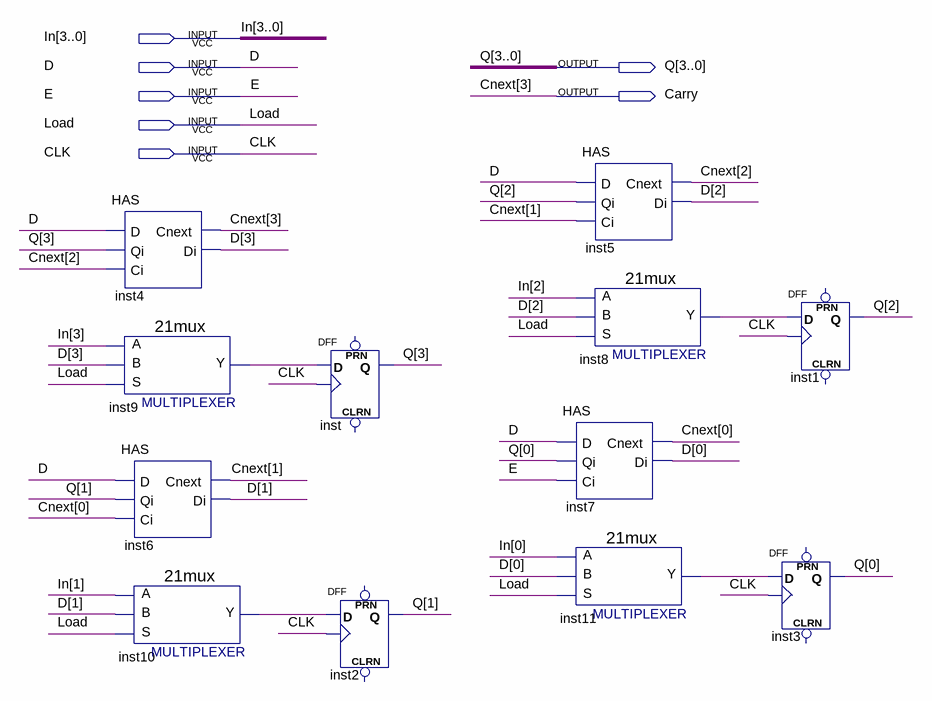
[diagram p0: schematic sheet]
// Quartus schematic counter.bdf as structural Verilog: 12 symbols, 7 pins
module counter (
  input  [3:0] In,
  input  D,
  input  E,
  input  Load,
  input  CLK,
  output [3:0] Q,
  output Carry
);

  wire inst8_y, inst9_y, inst10_y, inst11_y;
  wire [2:0] Cnext;
  wire [3:0] D_bus;

  HAS inst4 (.D(D), .Qi(Q[3]), .Ci(Cnext[2]), .Cnext(Carry), .Di(D_bus[3]));
  \21mux  inst9 (.S(Load), .B(D_bus[3]), .A(In[3]), .Y(inst9_y));
  HAS inst6 (.D(D), .Qi(Q[1]), .Ci(Cnext[0]), .Cnext(Cnext[1]), .Di(D_bus[1]));
  \21mux  inst10 (.S(Load), .B(D_bus[1]), .A(In[1]), .Y(inst10_y));
  DFF inst (.CLK(CLK), .D(inst9_y), .Q(Q[3]));  // open: CLRN, PRN
  DFF inst2 (.CLK(CLK), .D(inst10_y), .Q(Q[1]));  // open: CLRN, PRN
  HAS inst5 (.D(D), .Qi(Q[2]), .Ci(Cnext[1]), .Cnext(Cnext[2]), .Di(D_bus[2]));
  \21mux  inst8 (.S(Load), .B(D_bus[2]), .A(In[2]), .Y(inst8_y));
  HAS inst7 (.D(D), .Qi(Q[0]), .Ci(E), .Cnext(Cnext[0]), .Di(D_bus[0]));
  \21mux  inst11 (.S(Load), .B(D_bus[0]), .A(In[0]), .Y(inst11_y));
  DFF inst1 (.CLK(CLK), .D(inst8_y), .Q(Q[2]));  // open: CLRN, PRN
  DFF inst3 (.CLK(CLK), .D(inst11_y), .Q(Q[0]));  // open: CLRN, PRN

  // Other names for the same wires on the sheet: Cnext[3] = Carry
endmodule
